# Altium schematic sheet MCU et Communication.SchDoc: COMMUNICATION BLUETOOTH ET MCU
size A4; Date: 28/11/2024; DrawnBy: NOUBIGA Thierry; DocumentNumber: 1; Revision: V1.0 Rev A; SheetNumber: 4; SheetTotal: 7; Time: 14H55
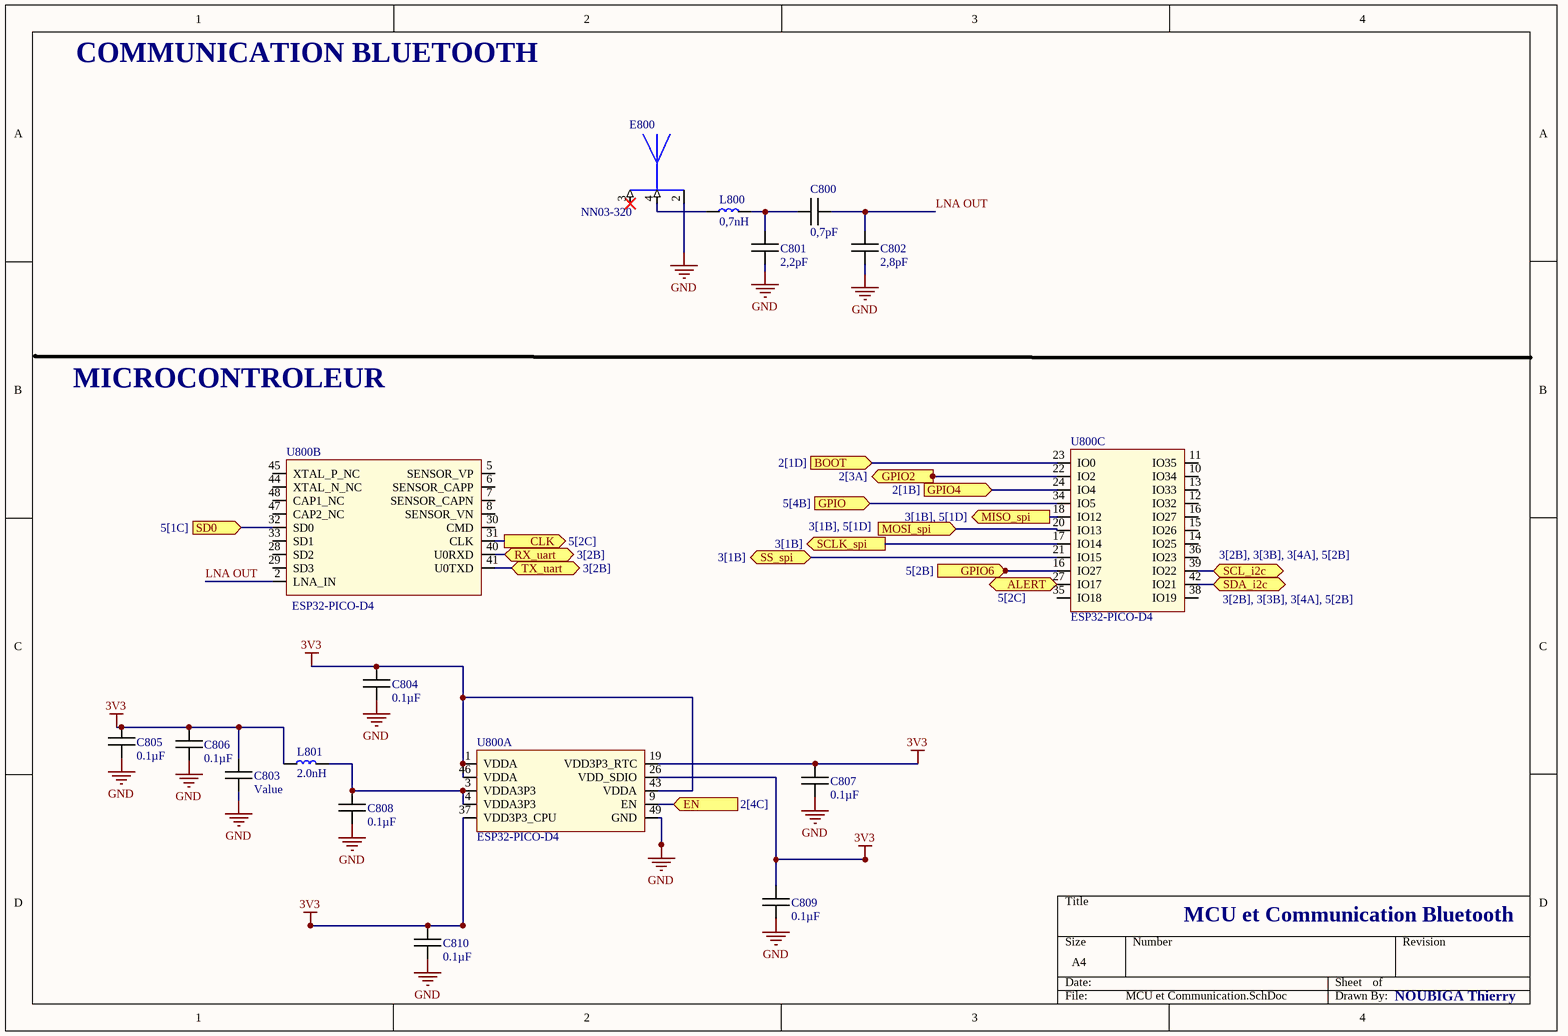
[diagram p0: MCU et Communication.SchDoc]

## Parts
C800  0,7pF  [CAPC1005X06N]
C801  2,2pF  [CAPC1005X06N]
C802  2,8pF  [CAPC1005X06N]
C803  Value  [CAPC1005X06N]
C804  0.1µF  [CAPC1005X06N]
C805  0.1µF  [CAPC1005X06N]
C806  0.1µF  [CAPC1005X06N]
C807  0.1µF  [CAPC1005X06N]
C808  0.1µF  [CAPC1005X06N]
C809  0.1µF  [CAPC1005X06N]
C810  0.1µF  [CAPC1005X06N]
E800  NN03-320  [XCVR_NN03-320]
L800  0,7nH  [LQPC1005X06N]
L801  2.0nH  [LQPC1005X06N]
U800  ESP32-PICO-D4  [PQFN50P700X700X104_HS-49N]  (parts A,B,C of 3)

## Ports
ALERT (bidir, see 5[2C]), BOOT (in, see 2[1D]), CLK (out, see 5[2C]), EN (in, see 2[4C]), GPIO2 (out, see 2[3A]), GPIO4 (in, see 2[1B]), GPIO6 (in, see 5[2B]), GPIO (in, see 5[4B]), MISO_spi (out, see 3[1B], 5[1D]), MOSI_spi (in, see 3[1B], 5[1D]), RX_uart (bidir, see 3[2B]), SCL_i2c (bidir, see 3[2B], 3[3B], 3[4A], 5[2B]), SCLK_spi (out, see 3[1B]), SD0 (in, see 5[1C]), SDA_i2c (bidir, see 3[2B], 3[3B], 3[4A], 5[2B]), SS_spi (bidir, see 3[1B]), TX_uart (bidir, see 3[2B])

## Nets
3V3: C803.1 C804.2 C805.2 C806.2 C807.1 C809.2 C810.1 L801.1 U800.1(VDDA) U800.19(VDD3P3_RTC) U800.26(VDD_SDIO) U800.37(VDD3P3_CPU) U800.43(VDDA) U800.46(VDDA)
GND: C801.2 C802.2 C803.2 C804.1 C805.1 C806.1 C807.2 C808.1 C809.1 C810.2 E800.2(GROUND) U800.49(GND)
ALERT: U800.27(IO17) ; port ALERT
BOOT: U800.23(IO0) ; port BOOT
CLK: U800.31(CLK) ; port CLK
EN: U800.9(EN) ; port EN
GPIO: U800.34(IO5) ; port GPIO
GPIO2: U800.22(IO2) ; port GPIO2
GPIO4: U800.24(IO4) ; port GPIO4
GPIO6: U800.16(IO27) ; port GPIO6
LNA OUT: C800.2 C802.1 U800.2(LNA_IN)
MISO_spi: U800.18(IO12) ; port MISO_spi
MOSI_spi: U800.20(IO13) ; port MOSI_spi
RX_uart: U800.40(U0RXD) ; port RX_uart
SCL_i2c: U800.39(IO22) ; port SCL_i2c
SCLK_spi: U800.17(IO14) ; port SCLK_spi
SD0: U800.32(SD0) ; port SD0
SDA_i2c: U800.42(IO21) ; port SDA_i2c
SS_spi: U800.21(IO15) ; port SS_spi
TX_uart: U800.41(U0TXD) ; port TX_uart
NetC800_1: C800.1 C801.1 L800.2
NetC808_2: C808.2 L801.2 U800.3(VDDA3P3) U800.4(VDDA3P3)
NetE800_4: E800.4(FEED_GNSS) L800.1

Not connected (* = marked no-connect by the designer): E800 3(FEED_BLUETOOTH)*; U800 5(SENSOR_VP) 6(SENSOR_CAPP) 7(SENSOR_CAPN) 8(SENSOR_VN) 10(IO34) 11(IO35) 12(IO32) 13(IO33) 14(IO25) 15(IO26) 28(SD2) 29(SD3) 30(CMD) 33(SD1) 35(IO18) 36(IO23) 38(IO19) 44(XTAL_N_NC) 45(XTAL_P_NC) 47(CAP2_NC) 48(CAP1_NC)

## Notes on the sheet
- COMMUNICATION BLUETOOTH
- MICROCONTROLEUR
- MCU et Communication Bluetooth
- NOUBIGA Thierry

## Library data of the parts
C800-C810 = Capacitor
E800 = NN03-320: Dual port antenna booster for GNSS, Bluetooth, 5G and UWB (1561 - 1606MHz, 2400 - 2500MHz, 3400 - 3800MHz, 3100 - 4800MHz and 6000 - 10600 MHz), signal booster; Manufacturer_Name: Ignion; Manufacturer_Part_Number: NN03-320; Mouser Part Number: 128-NN03-320
L800 L801 = Bobine
U800 = ESP32: Système RF sur puce - SoC SIP module ESP32 with 4MByte Flash, Dual Core MCU, Wi-Fi & Bluetooth Combo, LGA48-pin, 7*7mm; Manufacturer 1: Espressif Systems; Supplier 1: Digi-Key; Supplier Part Number 1: 1904-1029-1-ND; Manufacturer Part Number 1: ESP32-PICO-D4